# Altium schematic sheet PowerManagement.SchDoc
size A4; SheetNumber: 7; SheetTotal: 8
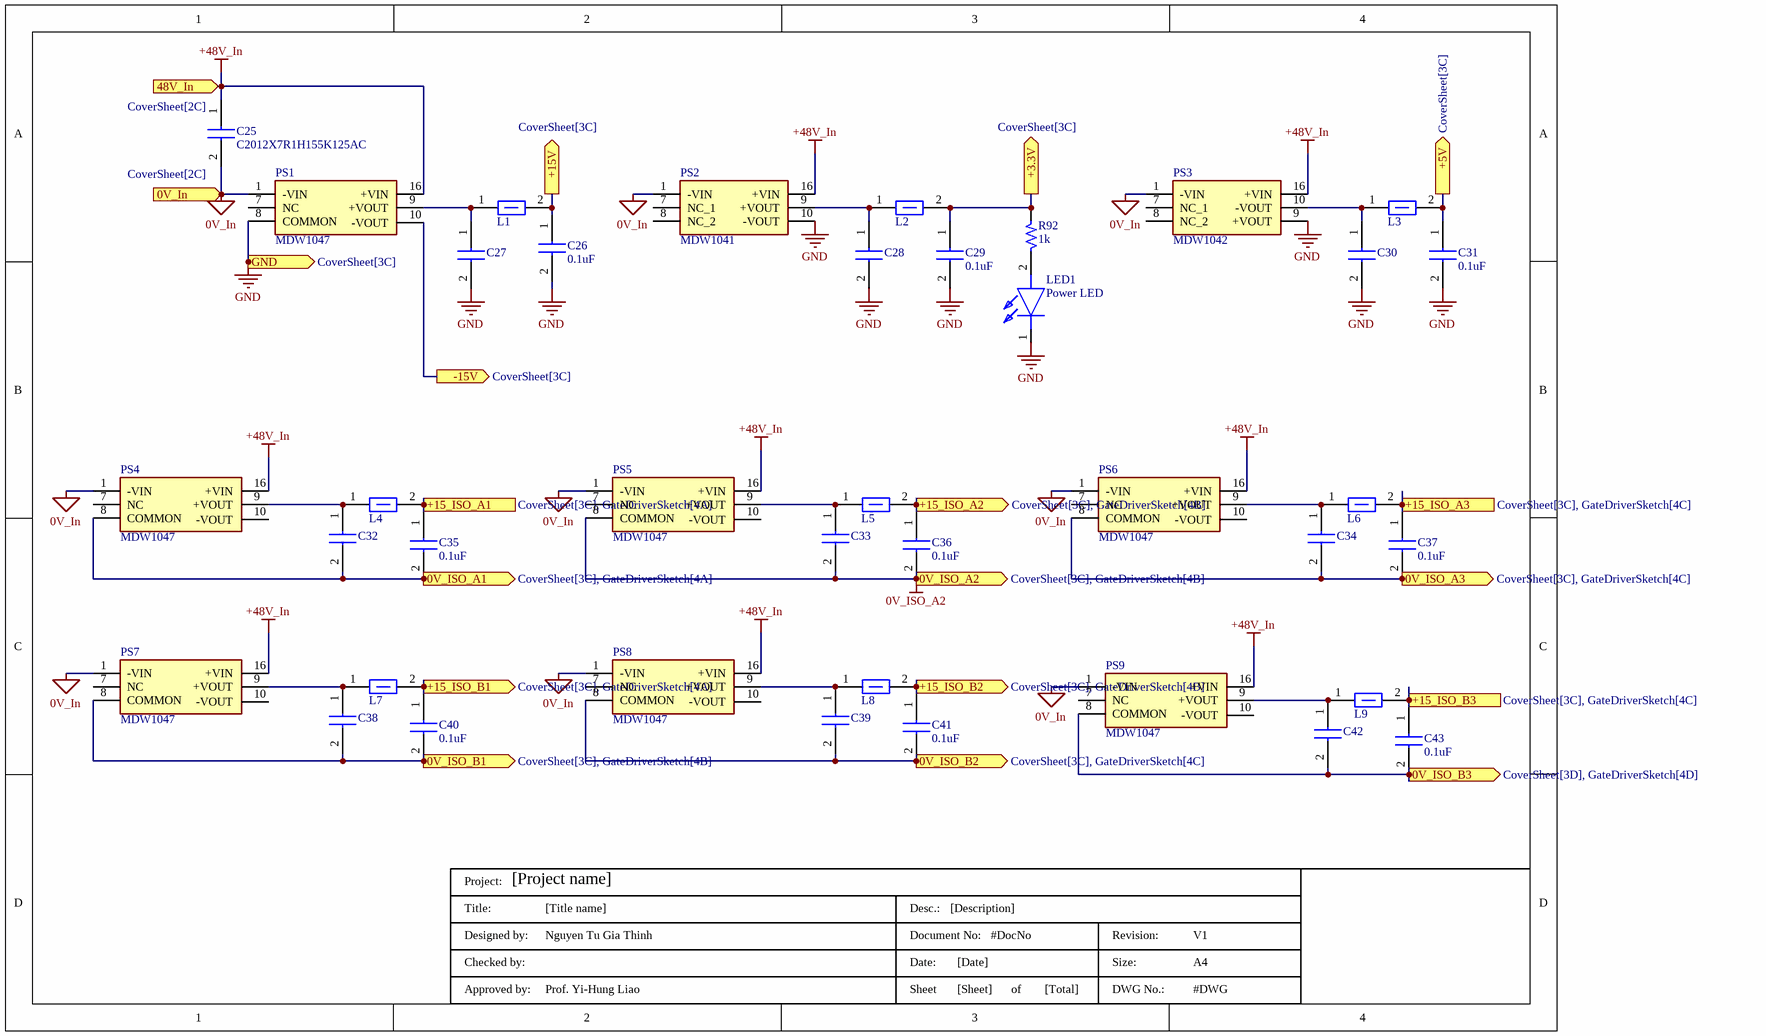
[diagram p0: PowerManagement.SchDoc]

## Parts
C25  C2012X7R1H155K125AC  [CAPC2012X145N]
C26  0.1uF  [C0805]
C27  CGA4J1X7R1E335K125AC  [CAPC2012X145N]  (value not drawn)
C28  CGA4J1X7R1E335K125AC  [CAPC2012X145N]  (value not drawn)
C29  0.1uF  [C0805]
C30  CGA4J1X7R1E335K125AC  [CAPC2012X145N]  (value not drawn)
C31  0.1uF  [C0805]
C32  CGA4J1X7R1E335K125AC  [CAPC2012X145N]  (value not drawn)
C33  CGA4J1X7R1E335K125AC  [CAPC2012X145N]  (value not drawn)
C34  CGA4J1X7R1E335K125AC  [CAPC2012X145N]  (value not drawn)
C35  0.1uF  [C0805]
C36  0.1uF  [C0805]
C37  0.1uF  [C0805]
C38  CGA4J1X7R1E335K125AC  [CAPC2012X145N]  (value not drawn)
C39  CGA4J1X7R1E335K125AC  [CAPC2012X145N]  (value not drawn)
C40  0.1uF  [C0805]
C41  0.1uF  [C0805]
C42  CGA4J1X7R1E335K125AC  [CAPC2012X145N]  (value not drawn)
C43  0.1uF  [C0805]
L1  MPZ2012S300A  [BEADC2012X105N]  (value not drawn)
L2  MPZ2012S300A  [BEADC2012X105N]  (value not drawn)
L3  MPZ2012S300A  [BEADC2012X105N]  (value not drawn)
L4  MPZ2012S300A  [BEADC2012X105N]  (value not drawn)
L5  MPZ2012S300A  [BEADC2012X105N]  (value not drawn)
L6  MPZ2012S300A  [BEADC2012X105N]  (value not drawn)
L7  MPZ2012S300A  [BEADC2012X105N]  (value not drawn)
L8  MPZ2012S300A  [BEADC2012X105N]  (value not drawn)
L9  MPZ2012S300A  [BEADC2012X105N]  (value not drawn)
LED1  Power LED  [LEDC2012X80N]
PS1  MDW1047  [MDEU0205D12HI]
PS2  MDW1041  [MDEU0205D12HI]
PS3  MDW1042  [MDEU0205D12HI]
PS4  MDW1047  [MDEU0205D12HI]
PS5  MDW1047  [MDEU0205D12HI]
PS6  MDW1047  [MDEU0205D12HI]
PS7  MDW1047  [MDEU0205D12HI]
PS8  MDW1047  [MDEU0205D12HI]
PS9  MDW1047  [MDEU0205D12HI]
R92  1k  [SM-1206]
TitleBlock  DWG No.: #DWG  Size:: A4  Revision:: V1  Total of Sheets: [Total]  Sheet: [Sheet]  Date:: [Date]  Document No:: #DocNo  Desc.:: [Description]  Approved by:: Prof. Yi-Hung Liao  Designed by:: Nguyen Tu Gia Thinh  Title:: [Title name]  Project: [Project name]  (hidden comment: TitleBlock)  (graphical)

## Ports
0V_In (in, see CoverSheet[2C]), 0V_ISO_A1 (out, see CoverSheet[3C], GateDriverSketch[4A]), 0V_ISO_A2 (out, see CoverSheet[3C], GateDriverSketch[4B]), 0V_ISO_A3 (out, see CoverSheet[3C], GateDriverSketch[4C]), 0V_ISO_B1 (out, see CoverSheet[3C], GateDriverSketch[4B]), 0V_ISO_B2 (out, see CoverSheet[3C], GateDriverSketch[4C]), 0V_ISO_B3 (out, see CoverSheet[3D], GateDriverSketch[4D]), 48V_In (in, see CoverSheet[2C]), +3.3V (out, see CoverSheet[3C]), +5V (out, see CoverSheet[3C]), +15_ISO_A1 (out, see CoverSheet[3C], GateDriverSketch[4A]), +15_ISO_A2 (out, see CoverSheet[3C], GateDriverSketch[4B]), +15_ISO_A3 (out, see CoverSheet[3C], GateDriverSketch[4C]), +15_ISO_B1 (out, see CoverSheet[3C], GateDriverSketch[4A]), +15_ISO_B2 (out, see CoverSheet[3C], GateDriverSketch[4B]), +15_ISO_B3 (out, see CoverSheet[3C], GateDriverSketch[4C]), +15V (out, see CoverSheet[3C]), -15V (out, see CoverSheet[3C]), GND (out, see CoverSheet[3C])

## Nets
0V_In: C25.2 PS1.1(-VIN) PS2.1(-VIN) PS3.1(-VIN) PS4.1(-VIN) PS5.1(-VIN) PS6.1(-VIN) PS7.1(-VIN) PS8.1(-VIN) PS9.1(-VIN) ; port 0V_In
0V_ISO_A2: C33.2 C36.2 PS5.8(COMMON) ; port 0V_ISO_A2
+48V_In: C25.1 PS1.16(+VIN) PS2.16(+VIN) PS3.16(+VIN) PS4.16(+VIN) PS5.16(+VIN) PS6.16(+VIN) PS7.16(+VIN) PS8.16(+VIN) PS9.16(+VIN) ; port 48V_In
GND: C26.2 C27.2 C28.2 C29.2 C30.2 C31.2 LED1.1(K) PS1.8(COMMON) PS2.10(-VOUT) PS3.9(+VOUT) ; port GND
0V_ISO_A1: C32.2 C35.2 PS4.8(COMMON) ; port 0V_ISO_A1
0V_ISO_A3: C34.2 C37.2 PS6.8(COMMON) ; port 0V_ISO_A3
0V_ISO_B1: C38.2 C40.2 PS7.8(COMMON) ; port 0V_ISO_B1
0V_ISO_B2: C39.2 C41.2 PS8.8(COMMON) ; port 0V_ISO_B2
0V_ISO_B3: C42.2 C43.2 PS9.8(COMMON) ; port 0V_ISO_B3
+3.3V: C29.1 L2.2 R92.2 ; port +3.3V
+5V: C31.1 L3.2 ; port +5V
+15_ISO_A1: C35.1 L4.2 ; port +15_ISO_A1
+15_ISO_A2: C36.1 L5.2 ; port +15_ISO_A2
+15_ISO_A3: C37.1 L6.2 ; port +15_ISO_A3
+15_ISO_B1: C40.1 L7.2 ; port +15_ISO_B1
+15_ISO_B2: C41.1 L8.2 ; port +15_ISO_B2
+15_ISO_B3: C43.1 L9.2 ; port +15_ISO_B3
+15V: C26.1 L1.2 ; port +15V
-15V: PS1.10(-VOUT) ; port -15V
NetC27_1: C27.1 L1.1 PS1.9(+VOUT)
NetC28_1: C28.1 L2.1 PS2.9(+VOUT)
NetC30_1: C30.1 L3.1 PS3.10(-VOUT)
NetC32_1: C32.1 L4.1 PS4.9(+VOUT)
NetC33_1: C33.1 L5.1 PS5.9(+VOUT)
NetC34_1: C34.1 L6.1 PS6.9(+VOUT)
NetC38_1: C38.1 L7.1 PS7.9(+VOUT)
NetC39_1: C39.1 L8.1 PS8.9(+VOUT)
NetC42_1: C42.1 L9.1 PS9.9(+VOUT)
NetLED1_2: LED1.2(A) R92.1

Not connected (* = marked no-connect by the designer): PS1 7(NC); PS2 7(NC_1) 8(NC_2); PS3 7(NC_1) 8(NC_2); PS4 7(NC) 10(-VOUT); PS5 7(NC) 10(-VOUT); PS6 7(NC) 10(-VOUT); PS7 7(NC) 10(-VOUT); PS8 7(NC) 10(-VOUT); PS9 7(NC) 10(-VOUT)

## Notes on the sheet
- (in symbol Title Block 2) Project:; Title:; Desc.:; Designed by:; Document No:; Revision:; Checked by:; Date:; Size:; Approved by:; Sheet; of; DWG No.:

## Library data of the parts
C25 = C2012X7R1H155K125AC: Capacitor; Manufacturer_Name: TDK; Datasheet Link: https://product.tdk.com/info/en/catalog/datasheets/mlcc_commercial_midvoltage_en.pdf; Height: 1.45mm; Manufacturer_Part_Number: C2012X7R1H155K125AC; Mouser Part Number: 810-C2012X7R1H155K; Mouser Price/Stock: https://www.mouser.co.uk/ProductDetail/TDK/C2012X7R1H155K125AC?qs=LcTL%2F5vFEzHRlIjTTCHR6Q%3D%3D; Arrow Part Number: C2012X7R1H155K125AC; Arrow Price/Stock: https://www.arrow.com/en/products/c2012x7r1h155k125ac/tdk
C26 C29 C31 C35-C37 C40 C41 C43 = C0805C104K3RACTU: Capacitor; Manufacturer_Name: KEMET; Datasheet Link: https://content.kemet.com/datasheets/KEM_C1002_X7R_SMD.pdf; Height: 1.1mm; Manufacturer_Part_Number: C0805C104K3RACTU; Mouser Part Number: 80-C0805C104K3R; Mouser Price/Stock: https://www.mouser.co.uk/ProductDetail/KEMET/C0805C104K3RACTU?qs=zZwvocWqSRjmUvfNxkIN%2Fg%3D%3D; Arrow Part Number: C0805C104K3RACTU; Arrow Price/Stock: https://www.arrow.com/en/products/c0805c104k3ractu/kemet-corporation; Capacitance: 0.1uF
C27 C28 C30 C32-C34 C38 C39 C42 = CGA4J1X7R1E335K125AC: Capacitor; Manufacturer_Name: TDK; Datasheet Link: http://docs-europe.electrocomponents.com/webdocs/14e9/0900766b814e9125.pdf; Height: 1.45mm; Manufacturer_Part_Number: CGA4J1X7R1E335K125AC; Mouser Part Number: 810-CGA4J1X7R1E335K; Mouser Price/Stock: https://www.mouser.co.uk/ProductDetail/TDK/CGA4J1X7R1E335K125AC?qs=NRhsANhppD9izo%2FI14TTIw%3D%3D; Arrow Part Number: CGA4J1X7R1E335K125AC; Arrow Price/Stock: https://www.arrow.com/en/products/cga4j1x7r1e335k125ac/tdk?region=nac
L1-L9 = MPZ2012S300A: Ferrite Bead; Manufacturer_Name: TDK; Datasheet Link: https://product.tdk.com/en/system/files?file=dam/doc/product/emc/emc/beads/catalog/beads_commercial_power_mpz2012_en.pdf; Height: 1.05mm; Manufacturer_Part_Number: MPZ2012S300A; Mouser Part Number: 810-MPZ2012S300A; Mouser Price/Stock: https://www.mouser.co.uk/ProductDetail/TDK/MPZ2012S300A?qs=rDWgVMYKtcPBZp31uUan%2FA%3D%3D
LED1 = 150080VS75000: LED; Manufacturer_Name: Wurth Elektronik; Datasheet Link: http://katalog.we-online.com/led/datasheet/150080VS75000.pdf; Height: 0.8mm; Manufacturer_Part_Number: 150080VS75000; Mouser Part Number: 710-150080VS75000; Mouser Price/Stock: https://www.mouser.co.uk/ProductDetail/Wurth-Elektronik/150080VS75000?qs=LlUlMxKIyB0tGHJmO6%252B0ug%3D%3D
PS1 PS4-PS9 = MDW1047: Power Supply; Manufacturer_Name: Minmax; Datasheet Link: https://www.minmaxpower.com/storage/media/Product-MINMAX/MDW1000/MDW1000_Datasheet.pdf; Height: 8.5mm; Manufacturer_Part_Number: MDW1047
PS2 = MDW1041: Power Supply; Manufacturer_Name: Minmax; Datasheet Link: https://www.minmaxpower.com/storage/media/Product-MINMAX/MDW1000/MDW1000_Datasheet.pdf; Height: 8.5mm; Manufacturer_Part_Number: MDW1041
PS3 = MDW1042: Power Supply; Manufacturer_Name: Minmax; Datasheet Link: https://www.minmaxpower.com/storage/media/Product-MINMAX/MDW1000/MDW1000_Datasheet.pdf; Height: 8.5mm; Manufacturer_Part_Number: MDW1042
R92 = R: Resistor 1/4W; Value: R1/4W - 1K
TitleBlock = Title Block 2